# EAGLE design SARA (EAGLE 9.3.0)
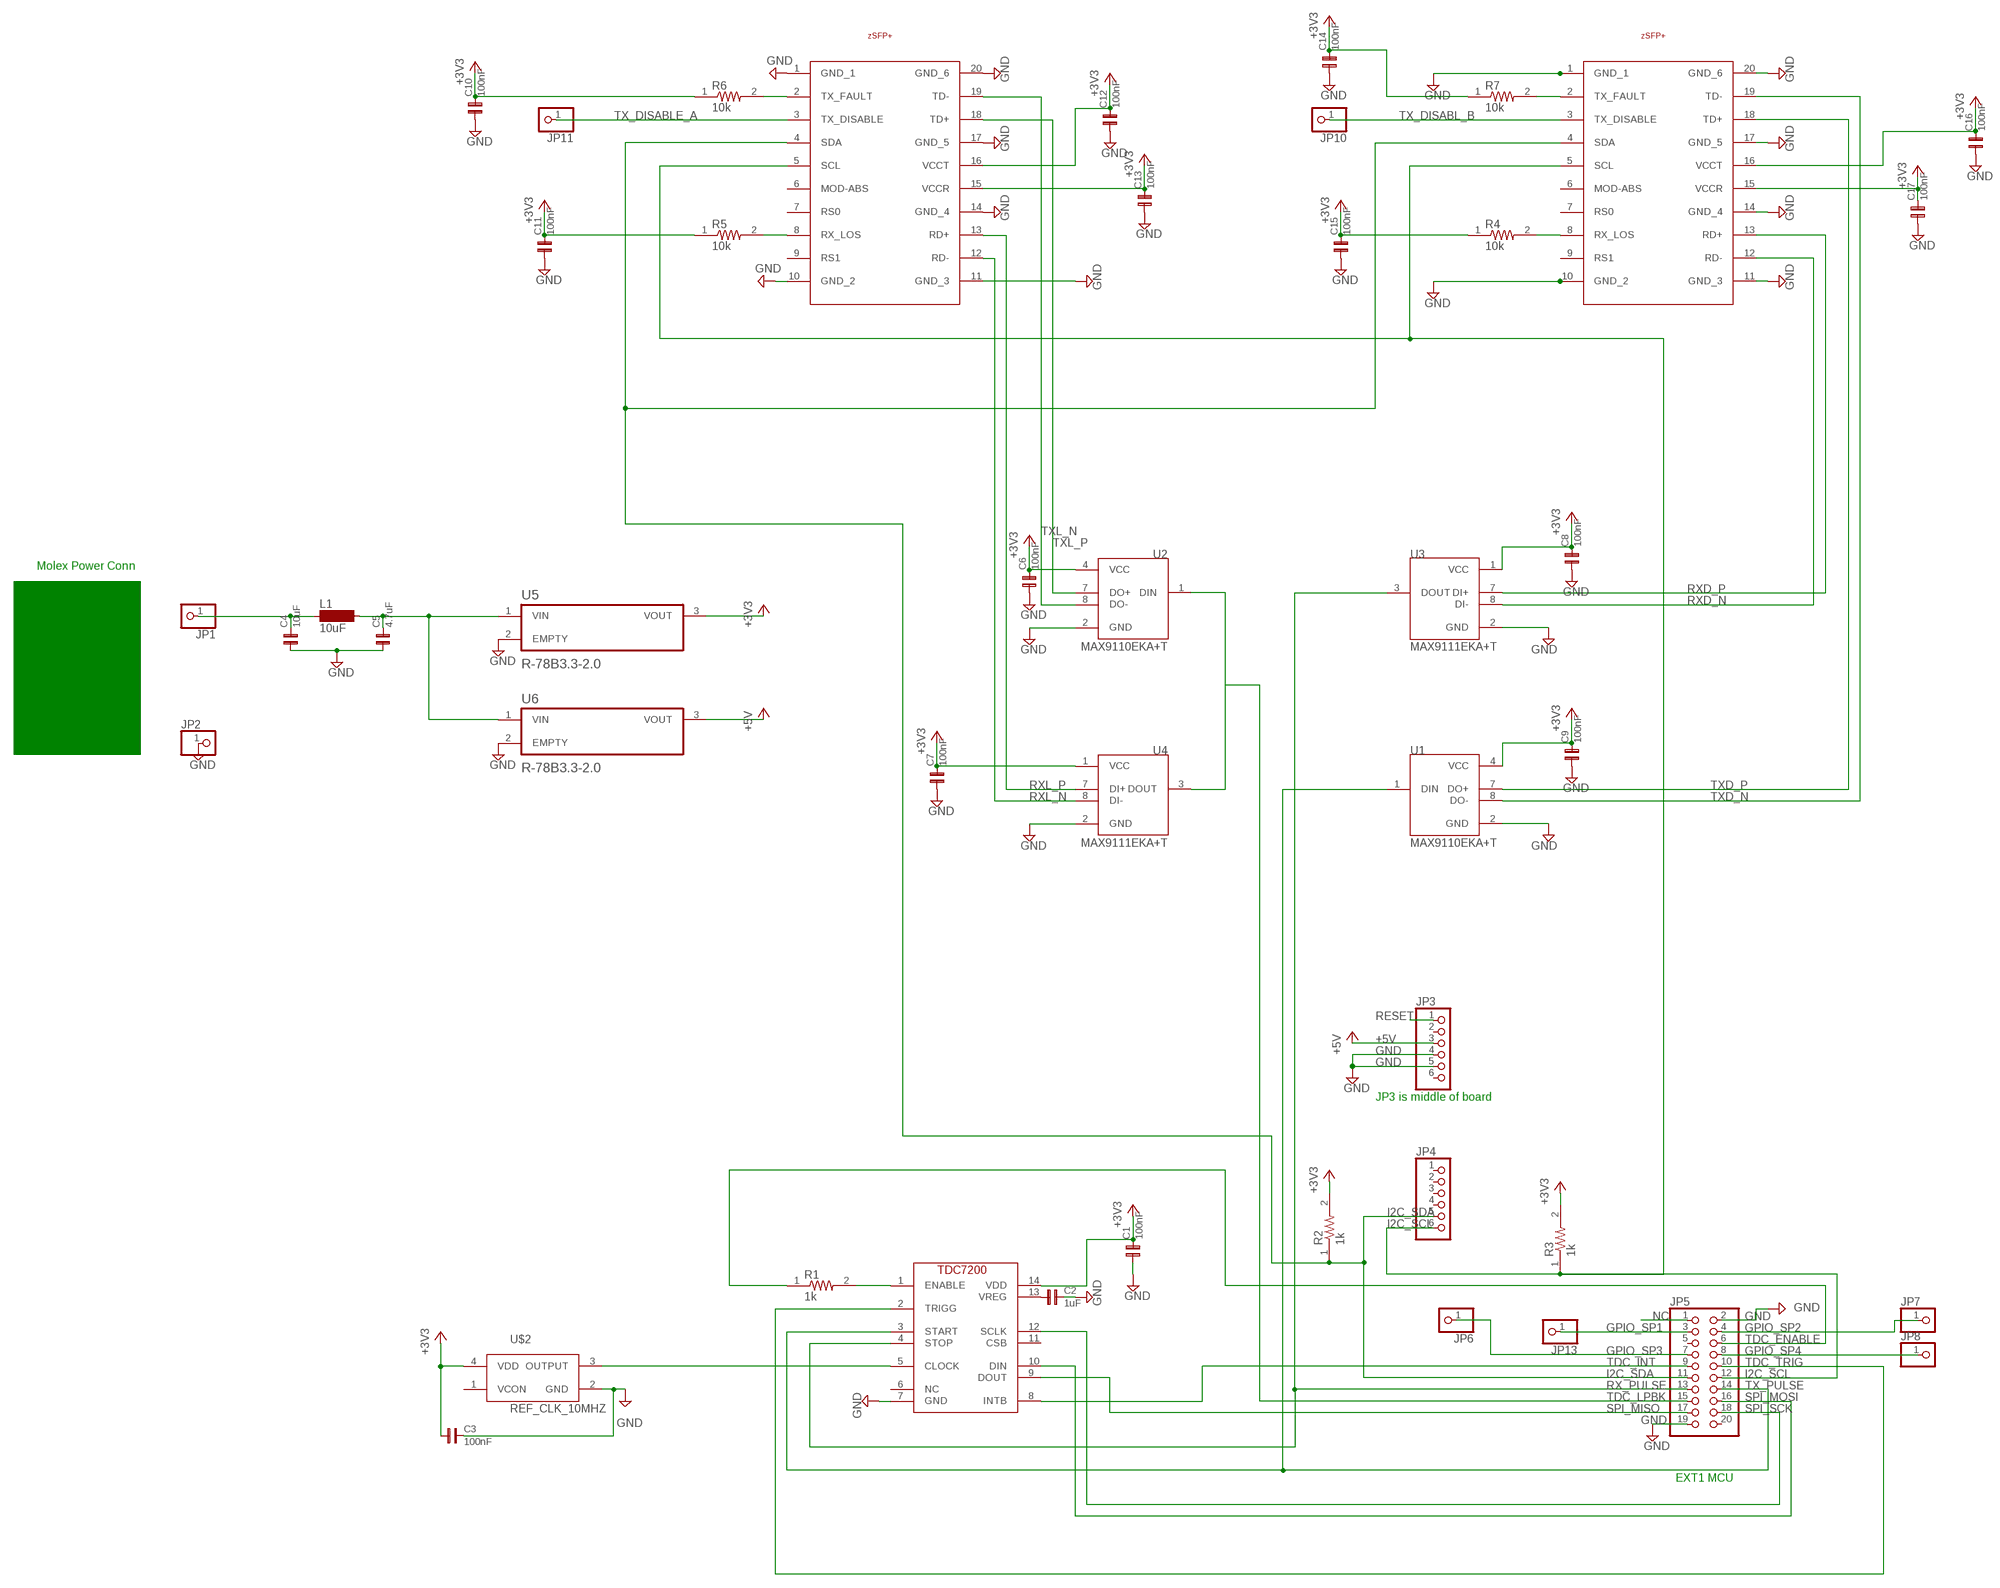
[diagram p0: schematic, sheet 1]

## Parts
C1  100nF  C0603  [0603]
C2  1uF  C0603  [0603]
C3  100nF  C0603  [0603]
C4  10uF  C0603  [0603]
C5  4.7uF  C0603  [0603]
C6  100nF  C0603  [0603]
C7  100nF  C0603  [0603]
C8  100nF  C0603  [0603]
C9  100nF  C0603  [0603]
C10  100nF  C0603  [0603]
C11  100nF  C0603  [0603]
C12  100nF  C0603  [0603]
C13  100nF  C0603  [0603]
C14  100nF  C0603  [0603]
C15  100nF  C0603  [0603]
C16  100nF  C0603  [0603]
C17  100nF  C0603  [0603]
JP1  PINHD-1X1  [1X01]
JP2  PINHD-1X1  [1X01]
JP3  PINHD-1X6  [1X06]
JP4  PINHD-1X6  [1X06]
JP5  PINHD-2X10  [2X10]
JP6  PINHD-1X1  [1X01]
JP7  PINHD-1X1  [1X01]
JP8  PINHD-1X1  [1X01]
JP10  PINHD-1X1  [1X01]
JP11  PINHD-1X1  [1X01]
JP13  PINHD-1X1  [1X01]
L1  10uF  MS50  [MS50]
R1  1k  RES_0603  [RESC1608X55]
R2  1k  RES_0603  [RESC1608X55]
R3  1k  RES_0603  [RESC1608X55]
R4  10k  RES_0603  [RESC1608X55]
R5  10k  RES_0603  [RESC1608X55]
R6  10k  RES_0603  [RESC1608X55]
R7  10k  RES_0603  [RESC1608X55]
SFP_DOWNSTREAM  ZSFP+  [ZSFP+]
SFP_UPSTREAM  ZSFP+  [ZSFP+]
U1  MAX9110EKA+T  [SOT65P280X145-8N]
U2  MAX9110EKA+T  [SOT65P280X145-8N]
U3  MAX9111EKA+T  [SOT65P280X145-8N]
U4  MAX9111EKA+T  [SOT65P280X145-8N]
U5  R-78B3.3-2.0  [CONV_R-78B15-2.0]
U6  R-78B3.3-2.0  [CONV_R-78B15-2.0]
U$1  TDC72007201PW  [SOP65P640X120-14N]
U$2  REF_CLK_10MHZ  [TWETMCJANF-10.000000]

## Nets
+3V1: C9.2 U1.4(VCC) ; supply symbol labelled +3V3
+3V2: C10.2 C11.2 C12.2 C13.2 C14.2 C15.2 C16.2 C17.2 R4.1 R5.1 R6.1 R7.1 SFP_DOWNSTREAM.15(VCCR) SFP_DOWNSTREAM.16(VCCT) SFP_UPSTREAM.15(VCCR) SFP_UPSTREAM.16(VCCT) ; supply symbol labelled +3V3
+3V3: C1.2 C3.1 C6.2 C7.2 C8.2 R2.2 R3.2 U2.4(VCC) U3.1(VCC) U4.1(VCC) U5.3(VOUT) U$1.14(VDD) U$2.4(VDD)
+5V: JP3.3 U6.3(VOUT)
GND: C1.1 C2.2 C3.2 C4.1 C5.1 C6.1 C7.1 C8.1 C9.1 C10.1 C11.1 C12.1 C13.1 C14.1 C15.1 C16.1 C17.1 JP2.1 JP3.4 JP3.5 JP5.2 JP5.19 SFP_DOWNSTREAM.1(GND_1) SFP_DOWNSTREAM.10(GND_2) SFP_DOWNSTREAM.11(GND_3) SFP_DOWNSTREAM.14(GND_4) SFP_DOWNSTREAM.17(GND_5) SFP_DOWNSTREAM.20(GND_6) SFP_UPSTREAM.1(GND_1) SFP_UPSTREAM.11(GND_3) SFP_UPSTREAM.14(GND_4) SFP_UPSTREAM.17(GND_5) SFP_UPSTREAM.20(GND_6) U1.2(GND) U2.2(GND) U3.2(GND) U4.2(GND) U5.2(EMPTY) U6.2(EMPTY) U$1.7(GND) U$2.2(GND)
GPIO_SP1: JP5.3 JP13.1
GPIO_SP2: JP5.4 JP7.1
GPIO_SP3: JP5.7 JP6.1
GPIO_SP4: JP5.8 JP8.1
I2C_SCL: JP4.6 JP5.12 R3.1 SFP_DOWNSTREAM.5(SCL) SFP_UPSTREAM.5(SCL)
I2C_SDA: JP4.5 JP5.11 R2.1 SFP_DOWNSTREAM.4(SDA) SFP_UPSTREAM.4(SDA)
N$1: R4.2 SFP_UPSTREAM.8(RX_LOS)
N$2: R1.2 U$1.1(ENABLE)
N$4: C2.1 U$1.13(VREG)
N$6: U$1.5(CLOCK) U$2.3(OUTPUT)
N$7: SFP_UPSTREAM.10(GND_2) ; supply symbol labelled GND
N$9: C5.2 L1.2 U5.1(VIN) U6.1(VIN)
N$18: U2.1(DIN) U4.3(DOUT)
N$19: R5.2 SFP_DOWNSTREAM.8(RX_LOS)
N$20: R6.2 SFP_DOWNSTREAM.2(TX_FAULT)
N$21: R7.2 SFP_UPSTREAM.2(TX_FAULT)
N$22: C4.2 JP1.1 L1.1
NC: JP5.1
RESET: JP3.1
RX_PULSE: JP5.13 U3.3(DOUT) U$1.4(STOP)
RXD_N: SFP_UPSTREAM.12(RD-) U3.8(DI-)
RXD_P: SFP_UPSTREAM.13(RD+) U3.7(DI+)
RXL_N: SFP_DOWNSTREAM.12(RD-) U4.8(DI-)
RXL_P: SFP_DOWNSTREAM.13(RD+) U4.7(DI+)
SPI_MISO: JP5.17 U$1.9(DOUT)
SPI_MOSI: JP5.16 U$1.10(DIN)
SPI_SCK: JP5.18 U$1.12(SCLK)
TDC_ENABLE: JP5.6 R1.1
TDC_INT: JP5.9 U$1.8(INTB)
TDC_LPBK: JP5.15
TDC_TRIG: JP5.10 U$1.2(TRIGG)
TX_DISABL_B: JP10.1 SFP_UPSTREAM.3(TX_DISABLE)
TX_DISABLE_A: JP11.1 SFP_DOWNSTREAM.3(TX_DISABLE)
TX_PULSE: JP5.14 U1.1(DIN) U$1.3(START)
TXD_N: SFP_UPSTREAM.19(TD-) U1.8(DO-)
TXD_P: SFP_UPSTREAM.18(TD+) U1.7(DO+)
TXL_N: SFP_DOWNSTREAM.19(TD-) U2.8(DO-)
TXL_P: SFP_DOWNSTREAM.18(TD+) U2.7(DO+)
Unconnected: JP3.2 JP3.6 JP4.1 JP4.2 JP4.3 JP4.4 JP5.5 JP5.20 SFP_DOWNSTREAM.6(MOD-ABS) SFP_DOWNSTREAM.7(RS0) SFP_DOWNSTREAM.9(RS1) SFP_UPSTREAM.6(MOD-ABS) SFP_UPSTREAM.7(RS0) SFP_UPSTREAM.9(RS1) U$1.6(NC) U$1.11(CSB) U$2.1(VCON)

## Notes on the sheet
- Molex Power Conn
- Molex Power Conn | Molex Power Conn
- JP3 is middle of board
- EXT1 MCU

## Library data of the parts
C1-C17 = capsmd:C0603
JP1 JP2 JP6-JP8 JP10 JP11 JP13 = pinhead:PINHD-1X1: PIN HEADER
JP3 JP4 = pinhead:PINHD-1X6: PIN HEADER
JP5 = pinhead:PINHD-2X10: PIN HEADER
L1 = inductor-neosid:MS50: INDUCTOR SMD power inductor; OC_FARNELL: unknown; OC_NEWARK: unknown
R1-R7 = RES_0603:RES_0603; AVAILABILITY: Unavailable; DESCRIPTION: Res Smd 0.047 Ohm 1% 0.4w 0603; MF: Vishay Dale; MP: WSLP0603R0470FEB; PACKAGE: 0603 Vishay Dale; PRICE: None
SFP_DOWNSTREAM SFP_UPSTREAM = zSFP+:ZSFP+
U1 U2 = MAX9110EKA_T:MAX9110EKA+T: The MAX9110 is a single LVDS transmitter; AVAILABILITY: Unavailable; DESCRIPTION: Single/Dual Lvds Line Driver With u; MF: Maxim Integrated; MP: MAX9110EKA+T; PACKAGE: SOT-23 Maxim Integrated; PRICE: None
U3 U4 = MAX9111EKA_T:MAX9111EKA+T
U5 U6 = R-78B3.3-2.0:R-78B3.3-2.0: None; AVAILABILITY: Unavailable; DESCRIPTION: Switching Regulator 4.75-32Vin 3.3Vo 2A; MF: Recom Power; MP: R-78B3.3-2.0; PACKAGE: SIP-3 Recom Power; PRICE: None
U$1 = TDC7200:TDC7200: TDC7200 chip made by Joe
U$2 = Ref_Clk:REF_CLK_10MHZ

## Net classes
1 Diff: width 1.27 mm, clearance 0.381 mm

## Board
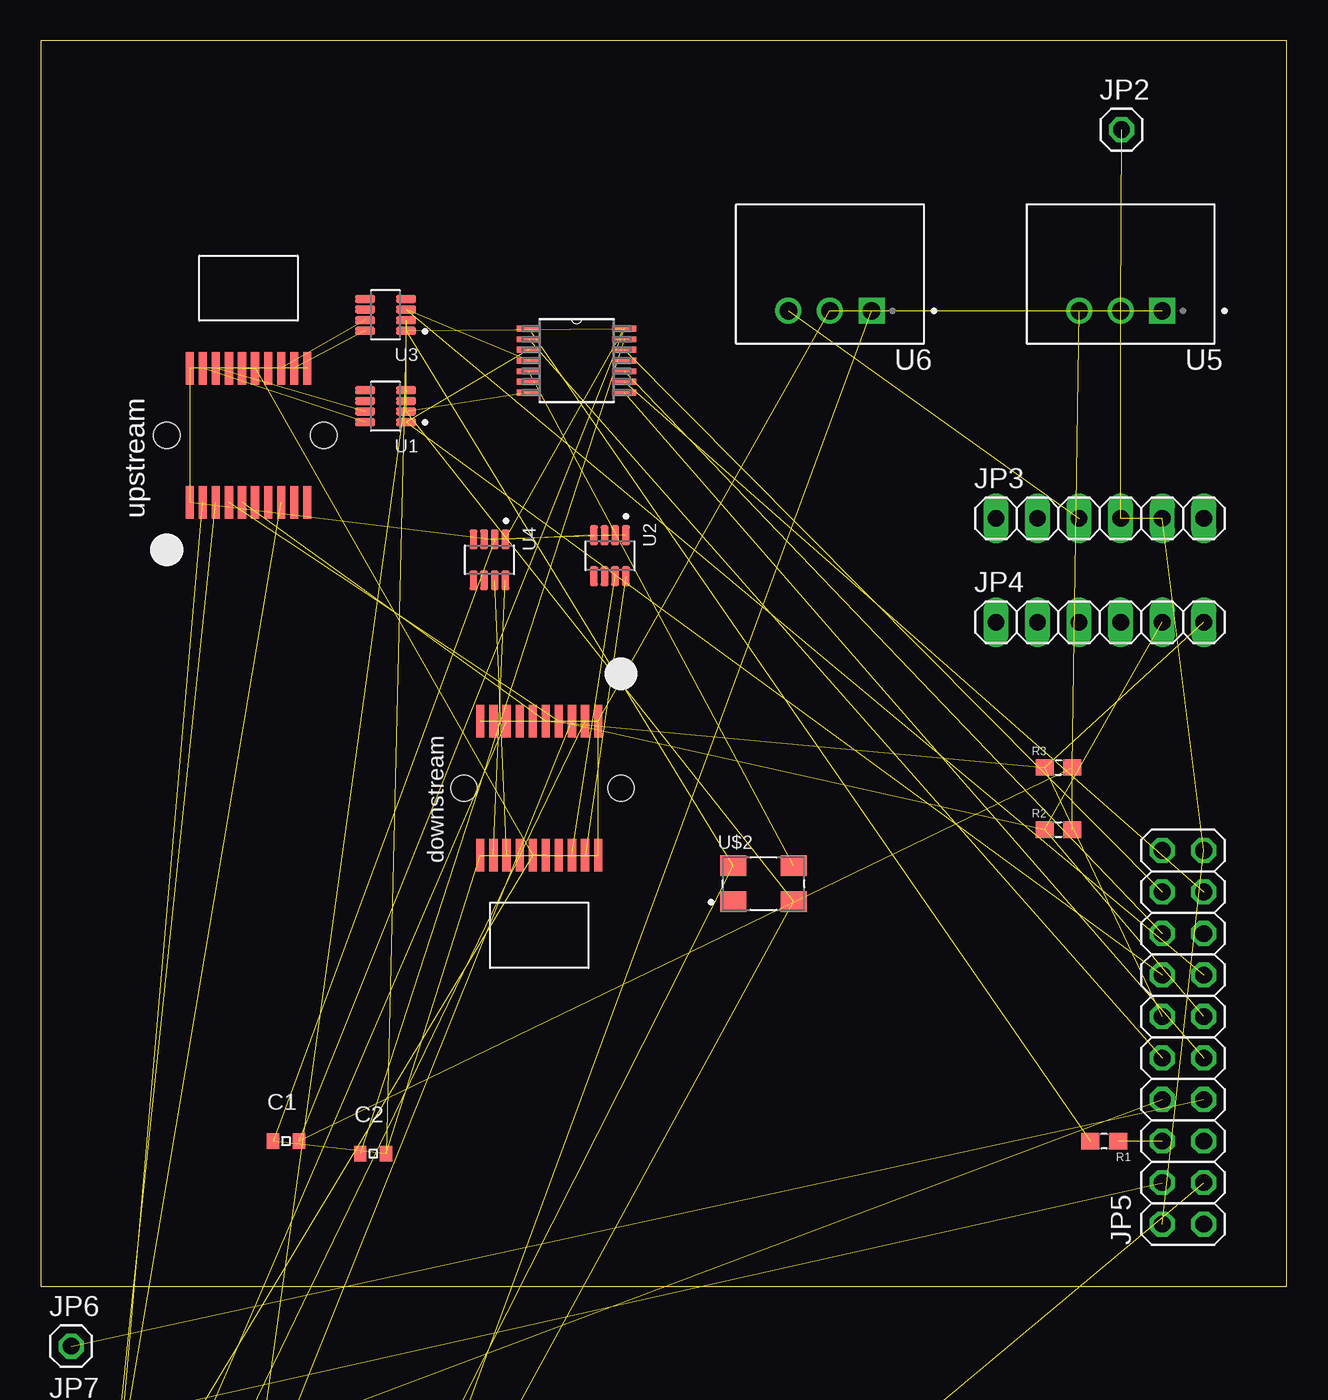
[diagram p1: board, top side]
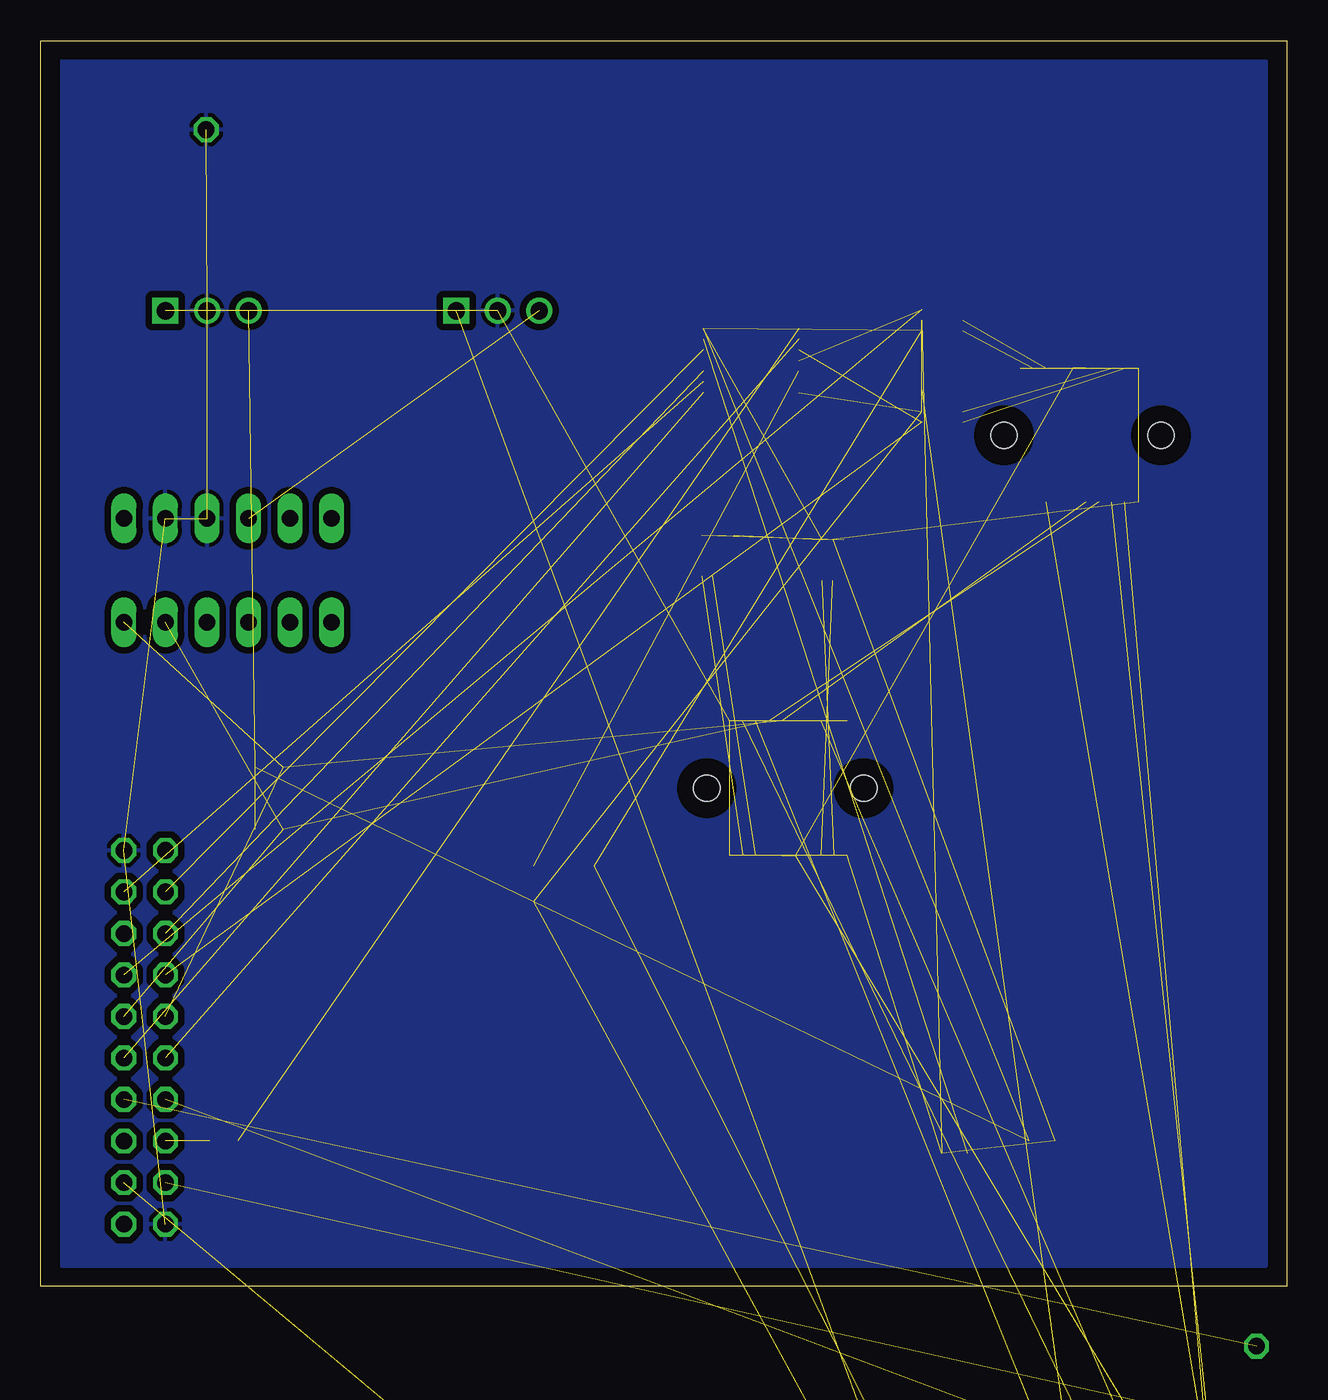
[diagram p2: board, bottom side, seen from below]

Size 76.2 x 76.2 mm. Coordinates in mm from the lower left corner, seen from the top.
Outline: 0,0 76.2,0 76.2,76.2 0,76.2 0,0
Copper layers (1*16): Top 0.035mm / dielectric 1.5mm / Bottom 0.035mm
Design rules "default": minimum track width 6mil, minimum drill 0.35mm, track to track 6mil, track to pad 6mil, pad to pad 6mil, via to via 6mil, smd to smd 6mil, copper to edge 40mil, drill to drill 6mil, minimum pad ring 10mil, minimum via ring 8mil, stop-mask expansion 4mil, vias tented up to drill 0mil, thermal gap 10mil

### Footprints (pad centres in the part's own frame; a part is rotated, then mirrored left to right if it is on the bottom)
0603 = smd 0.762 x 0.965: 1 -0.787,0; 2 0.787,0
1X01 = drill 1.016 octagon: 1 0,0
1X06 = drill 1.016 long: 1 -6.35,0; 2 -3.81,0; 3 -1.27,0; 4 1.27,0; 5 3.81,0; 6 6.35,0
2X10 = drill 1.016 octagon: 1 -11.43,-1.27; 2 -11.43,1.27; 3 -8.89,-1.27; 4 -8.89,1.27; 5 -6.35,-1.27; 6 -6.35,1.27; 7 -3.81,-1.27; 8 -3.81,1.27; 9 -1.27,-1.27; 10 -1.27,1.27; 11 1.27,-1.27; 12 1.27,1.27; 13 3.81,-1.27; 14 3.81,1.27; 15 6.35,-1.27; 16 6.35,1.27; 17 8.89,-1.27; 18 8.89,1.27; 19 11.43,-1.27; 20 11.43,1.27
MS50 = smd 2.8 x 1.4: 1 0,-1.7; 2 0,1.7
RESC1608X55 = smd 1.1 x 1: 1 -0.85,0; 2 0.85,0
ZSFP+ = smd 0.5 x 2: 1 -3.6,-4.1; 2 -2.8,-4.1; 3 -2,-4.1; 4 -1.2,-4.1; 5 -0.4,-4.1; 6 0.4,-4.1; 7 1.2,-4.1; 8 2,-4.1; 9 2.8,-4.1; 10 3.6,-4.1; 11 3.6,4.1; 12 2.8,4.1; 13 2,4.1; 14 1.2,4.1; 15 0.4,4.1; 16 -0.4,4.1; 17 -1.2,4.1; 18 -2,4.1; 19 -2.8,4.1; 20 -3.6,4.1 | hole 1.6: -5,0; 4.6,0
SOT65P280X145-8N = smd 1.21 x 0.48: 1 -1.255,0.975; 2 -1.255,0.325; 3 -1.255,-0.325; 4 -1.255,-0.975; 5 1.255,-0.975; 6 1.255,-0.325; 7 1.255,0.325; 8 1.255,0.975
CONV_R-78B15-2.0 = drill 1.06 square: 1 0,0 | drill 1.06: 2 2.54,0; 3 5.08,0
SOP65P640X120-14N = smd 1.473 x 0.356: 1 -2.921,1.956; 2 -2.921,1.295; 3 -2.921,0.66; 4 -2.921,0; 5 -2.921,-0.66; 6 -2.921,-1.295; 7 -2.921,-1.956; 8 2.921,-1.956; 9 2.921,-1.295; 10 2.921,-0.66; 11 2.921,0; 12 2.921,0.66; 13 2.921,1.295; 14 2.921,1.956
TWETMCJANF-10.000000 = smd 1.6 x 1.25: 1 -1.85,-1.1; 2 1.85,-1.1; 3 1.85,1.1; 4 -1.85,1.1

### Placement (x,y rotation side)
C1  14.99,8.89 0 top
C2  20.32,8.13 0 top
C3  1.65,-56.34 0 top  (outside the outline)
C4  1.65,-67.21 0 top  (outside the outline)
C5  1.65,-71.6 0 top  (outside the outline)
C6  1.65,-76 0 top  (outside the outline)
C7  1.65,-80.39 0 top  (outside the outline)
C8  1.65,-84.79 0 top  (outside the outline)
C9  1.65,-89.18 0 top  (outside the outline)
C10  1.65,-93.57 0 top  (outside the outline)
C11  1.65,-97.97 0 top  (outside the outline)
C12  1.65,-102.36 0 top  (outside the outline)
C13  1.65,-106.76 0 top  (outside the outline)
C14  1.65,-111.15 0 top  (outside the outline)
C15  1.65,-115.54 0 top  (outside the outline)
C16  1.65,-119.94 0 top  (outside the outline)
C17  1.91,-125.73 0 top  (outside the outline)
JP1  7.8,-67.56 0 top  (outside the outline)
JP2  66.09,70.76 0 top
JP3  64.77,46.99 0 top
JP4  64.77,40.64 0 top
JP5  69.85,15.24 90 top
JP6  1.85,-3.66 0 top  (outside the outline)
JP7  1.85,-8.66 0 top  (outside the outline)
JP8  1.85,-13.67 0 top  (outside the outline)
JP10  1.85,-36.6 0 top  (outside the outline)
JP11  1.85,-41.61 0 top  (outside the outline)
JP13  1.85,-51.61 0 top  (outside the outline)
L1  -5.54,-69.42 180 top  (outside the outline)
R1  65.02,8.89 180 top
R2  62.23,27.94 0 top
R3  62.23,31.75 0 top
R4  2.16,-21.49 0 top  (outside the outline)
R5  2.16,-24.71 0 top  (outside the outline)
R6  2.16,-27.94 0 top  (outside the outline)
R7  2.16,-31.17 0 top  (outside the outline)
SFP_DOWNSTREAM  30.48,30.48 180 top
SFP_UPSTREAM  12.7,52.07 0 top
U1  21.08,53.85 180 top
U2  34.8,44.7 270 top
U3  21.08,59.44 180 top
U4  27.43,44.45 270 top
U5  68.58,59.69 180 top
U6  50.8,59.69 180 top
U$1  32.77,56.64 0 top
U$2  44.2,24.64 0 top

### Tracks (layer width: path | path; a pad name or v marks a point on that pad's centre or on a via)
+3V1  (1 unrouted)
+3V2  (15 unrouted)
+3V3  (12 unrouted)
+5V  (1 unrouted)
GND  (40 unrouted)
  pour Bottom (isolate 0.406): 1.27,1.27 1.27,74.93 74.93,74.93 74.93,1.27
GPIO_SP1  (1 unrouted)
GPIO_SP2  (1 unrouted)
GPIO_SP3  (1 unrouted)
GPIO_SP4  (1 unrouted)
I2C_SCL  (4 unrouted)
I2C_SDA  (4 unrouted)
N$1  (1 unrouted)
N$2  (1 unrouted)
N$4  (1 unrouted)
N$6  (1 unrouted)
N$9  (3 unrouted)
N$18  (1 unrouted)
N$19  (1 unrouted)
N$20  (1 unrouted)
N$21  (1 unrouted)
N$22  (2 unrouted)
RX_PULSE  (2 unrouted)
RXD_N  (1 unrouted)
RXD_P  (1 unrouted)
RXL_N  (1 unrouted)
RXL_P  (1 unrouted)
SPI_MISO  (1 unrouted)
SPI_MOSI  (1 unrouted)
SPI_SCK  (1 unrouted)
TDC_ENABLE  (1 unrouted)
TDC_INT  (1 unrouted)
TDC_TRIG  (1 unrouted)
TX_DISABL_B  (1 unrouted)
TX_DISABLE_A  (1 unrouted)
TX_PULSE  (2 unrouted)
TXD_N  (1 unrouted)
TXD_P  (1 unrouted)
TXL_N  (1 unrouted)
  Top 0.152: SFP_DOWNSTREAM.19
TXL_P  (1 unrouted)

### Text on the board
tPlace: upstream
tNames: downstream